# Altium schematic sheet 03_DUT_Connector.SchDoc
size A4; SheetNumber: 4; SheetTotal: 4
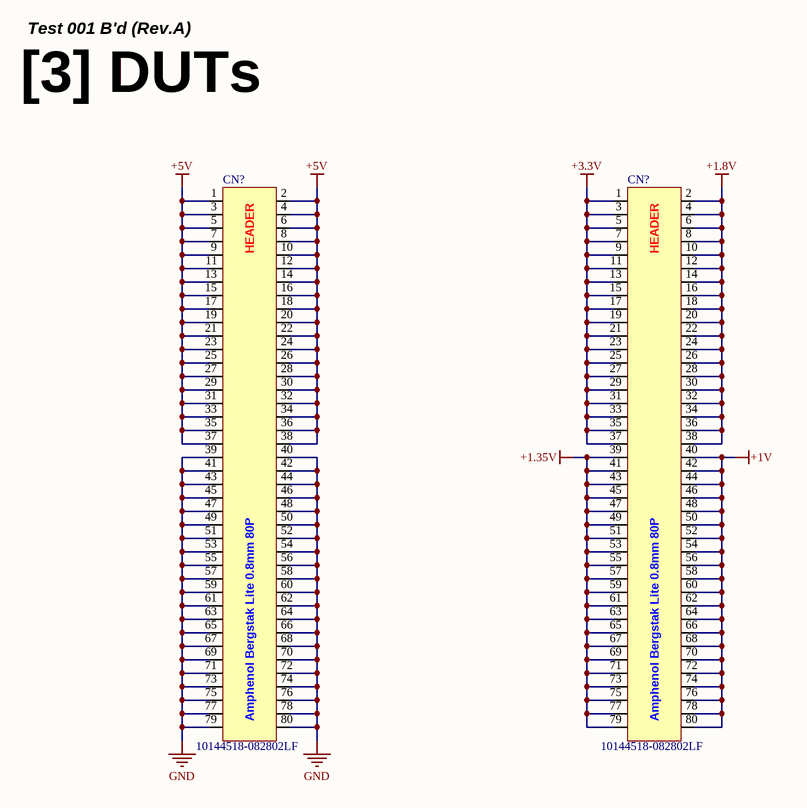
[diagram p0: 03_DUT_Connector.SchDoc]

## Parts
(Parts that share a designator on the sheet are numbered #1, #2 ... from top to bottom, then left to right.)
CN?#1  10144518-082802LF  [10144518-082802LF]
CN?#2  10144518-082802LF  [10144518-082802LF]

## Nets
+1.8V: CN?#2.2 CN?#2.4 CN?#2.6 CN?#2.8 CN?#2.10 CN?#2.12 CN?#2.14 CN?#2.16 CN?#2.18 CN?#2.20 CN?#2.22 CN?#2.24 CN?#2.26 CN?#2.28 CN?#2.30 CN?#2.32 CN?#2.34 CN?#2.36 CN?#2.38
+1.35V: CN?#2.39 CN?#2.41 CN?#2.43 CN?#2.45 CN?#2.47 CN?#2.49 CN?#2.51 CN?#2.53 CN?#2.55 CN?#2.57 CN?#2.59 CN?#2.61 CN?#2.63 CN?#2.65 CN?#2.67 CN?#2.69 CN?#2.71 CN?#2.73 CN?#2.75 CN?#2.77 CN?#2.79
+1V: CN?#2.40 CN?#2.42 CN?#2.44 CN?#2.46 CN?#2.48 CN?#2.50 CN?#2.52 CN?#2.54 CN?#2.56 CN?#2.58 CN?#2.60 CN?#2.62 CN?#2.64 CN?#2.66 CN?#2.68 CN?#2.70 CN?#2.72 CN?#2.74 CN?#2.76 CN?#2.78 CN?#2.80
+3.3V: CN?#2.1 CN?#2.3 CN?#2.5 CN?#2.7 CN?#2.9 CN?#2.11 CN?#2.13 CN?#2.15 CN?#2.17 CN?#2.19 CN?#2.21 CN?#2.23 CN?#2.25 CN?#2.27 CN?#2.29 CN?#2.31 CN?#2.33 CN?#2.35 CN?#2.37
+5V: CN?#1.1 CN?#1.2 CN?#1.3 CN?#1.4 CN?#1.5 CN?#1.6 CN?#1.7 CN?#1.8 CN?#1.9 CN?#1.10 CN?#1.11 CN?#1.12 CN?#1.13 CN?#1.14 CN?#1.15 CN?#1.16 CN?#1.17 CN?#1.18 CN?#1.19 CN?#1.20 CN?#1.21 CN?#1.22 CN?#1.23 CN?#1.24 CN?#1.25 CN?#1.26 CN?#1.27 CN?#1.28 CN?#1.29 CN?#1.30 CN?#1.31 CN?#1.32 CN?#1.33 CN?#1.34 CN?#1.35 CN?#1.36 CN?#1.37 CN?#1.38
GND: CN?#1.39 CN?#1.40 CN?#1.41 CN?#1.42 CN?#1.43 CN?#1.44 CN?#1.45 CN?#1.46 CN?#1.47 CN?#1.48 CN?#1.49 CN?#1.50 CN?#1.51 CN?#1.52 CN?#1.53 CN?#1.54 CN?#1.55 CN?#1.56 CN?#1.57 CN?#1.58 CN?#1.59 CN?#1.60 CN?#1.61 CN?#1.62 CN?#1.63 CN?#1.64 CN?#1.65 CN?#1.66 CN?#1.67 CN?#1.68 CN?#1.69 CN?#1.70 CN?#1.71 CN?#1.72 CN?#1.73 CN?#1.74 CN?#1.75 CN?#1.76 CN?#1.77 CN?#1.78 CN?#1.79 CN?#1.80

## Notes on the sheet
- Test 001 B'd (Rev.A)
- [3] DUTs
- Title
- Rev
- Doc
- Sheet #
- of
- Author
- This document is copyright of ArkX and shall not be revealed, produced, copied, in whole or in part,
- Date
- nor used for any purpose other than submitted.
- (in symbol CON_10144518-082802LF) HEADER; Amphenol Bergstak Lite 0.8mm 80P

## Library data of the parts
CN?#1 CN?#2 = CON_10144518-082802LF: BergStak® Lite 0.80mm, Board-to-Board Connector, 80 Positions, Dual Row, Vertical Header; Manufacturer: Amphenol; Manufacturer Part Number: 10144518-082802LF